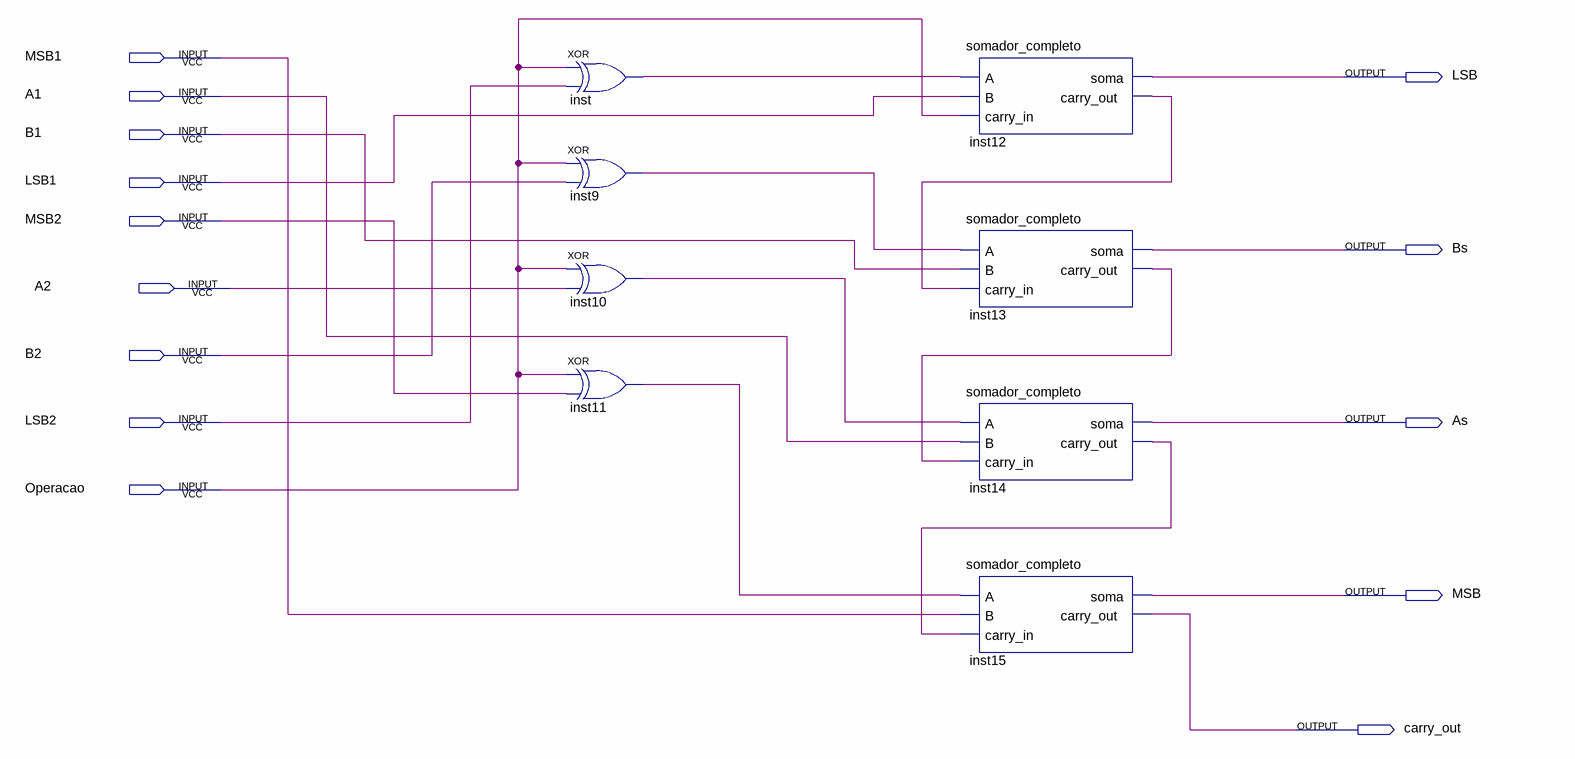
[diagram p0: schematic sheet]
// Quartus schematic soma_e_subtracao.bdf as structural Verilog: 8 symbols, 14 pins
module soma_e_subtracao (
  input  MSB1,
  input  A1,
  input  B1,
  input  LSB1,
  input  MSB2,
  input  A2,
  input  B2,
  input  LSB2,
  input  Operacao,
  output LSB,
  output Bs,
  output As,
  output MSB,
  output carry_out
);

  wire inst9_out, inst10_out, inst11_out, inst12_carry_out, inst13_carry_out, inst14_carry_out, inst_out;

  xor inst (inst_out, Operacao, LSB2);
  xor inst9 (inst9_out, Operacao, B2);
  xor inst10 (inst10_out, Operacao, A2);
  xor inst11 (inst11_out, Operacao, MSB2);
  somador_completo inst12 (.A(inst_out), .B(LSB1), .carry_in(Operacao), .soma(LSB), .carry_out(inst12_carry_out));
  somador_completo inst13 (.A(inst9_out), .B(B1), .carry_in(inst12_carry_out), .soma(Bs), .carry_out(inst13_carry_out));
  somador_completo inst14 (
    .A(inst10_out), .B(A1), .carry_in(inst13_carry_out), .soma(As), .carry_out(inst14_carry_out));
  somador_completo inst15 (.A(inst11_out), .B(MSB1), .carry_in(inst14_carry_out), .soma(MSB), .carry_out(carry_out));
endmodule
